# EAGLE design H1DR00 (EAGLE 9.6.0)

## Sheet 1 of 2
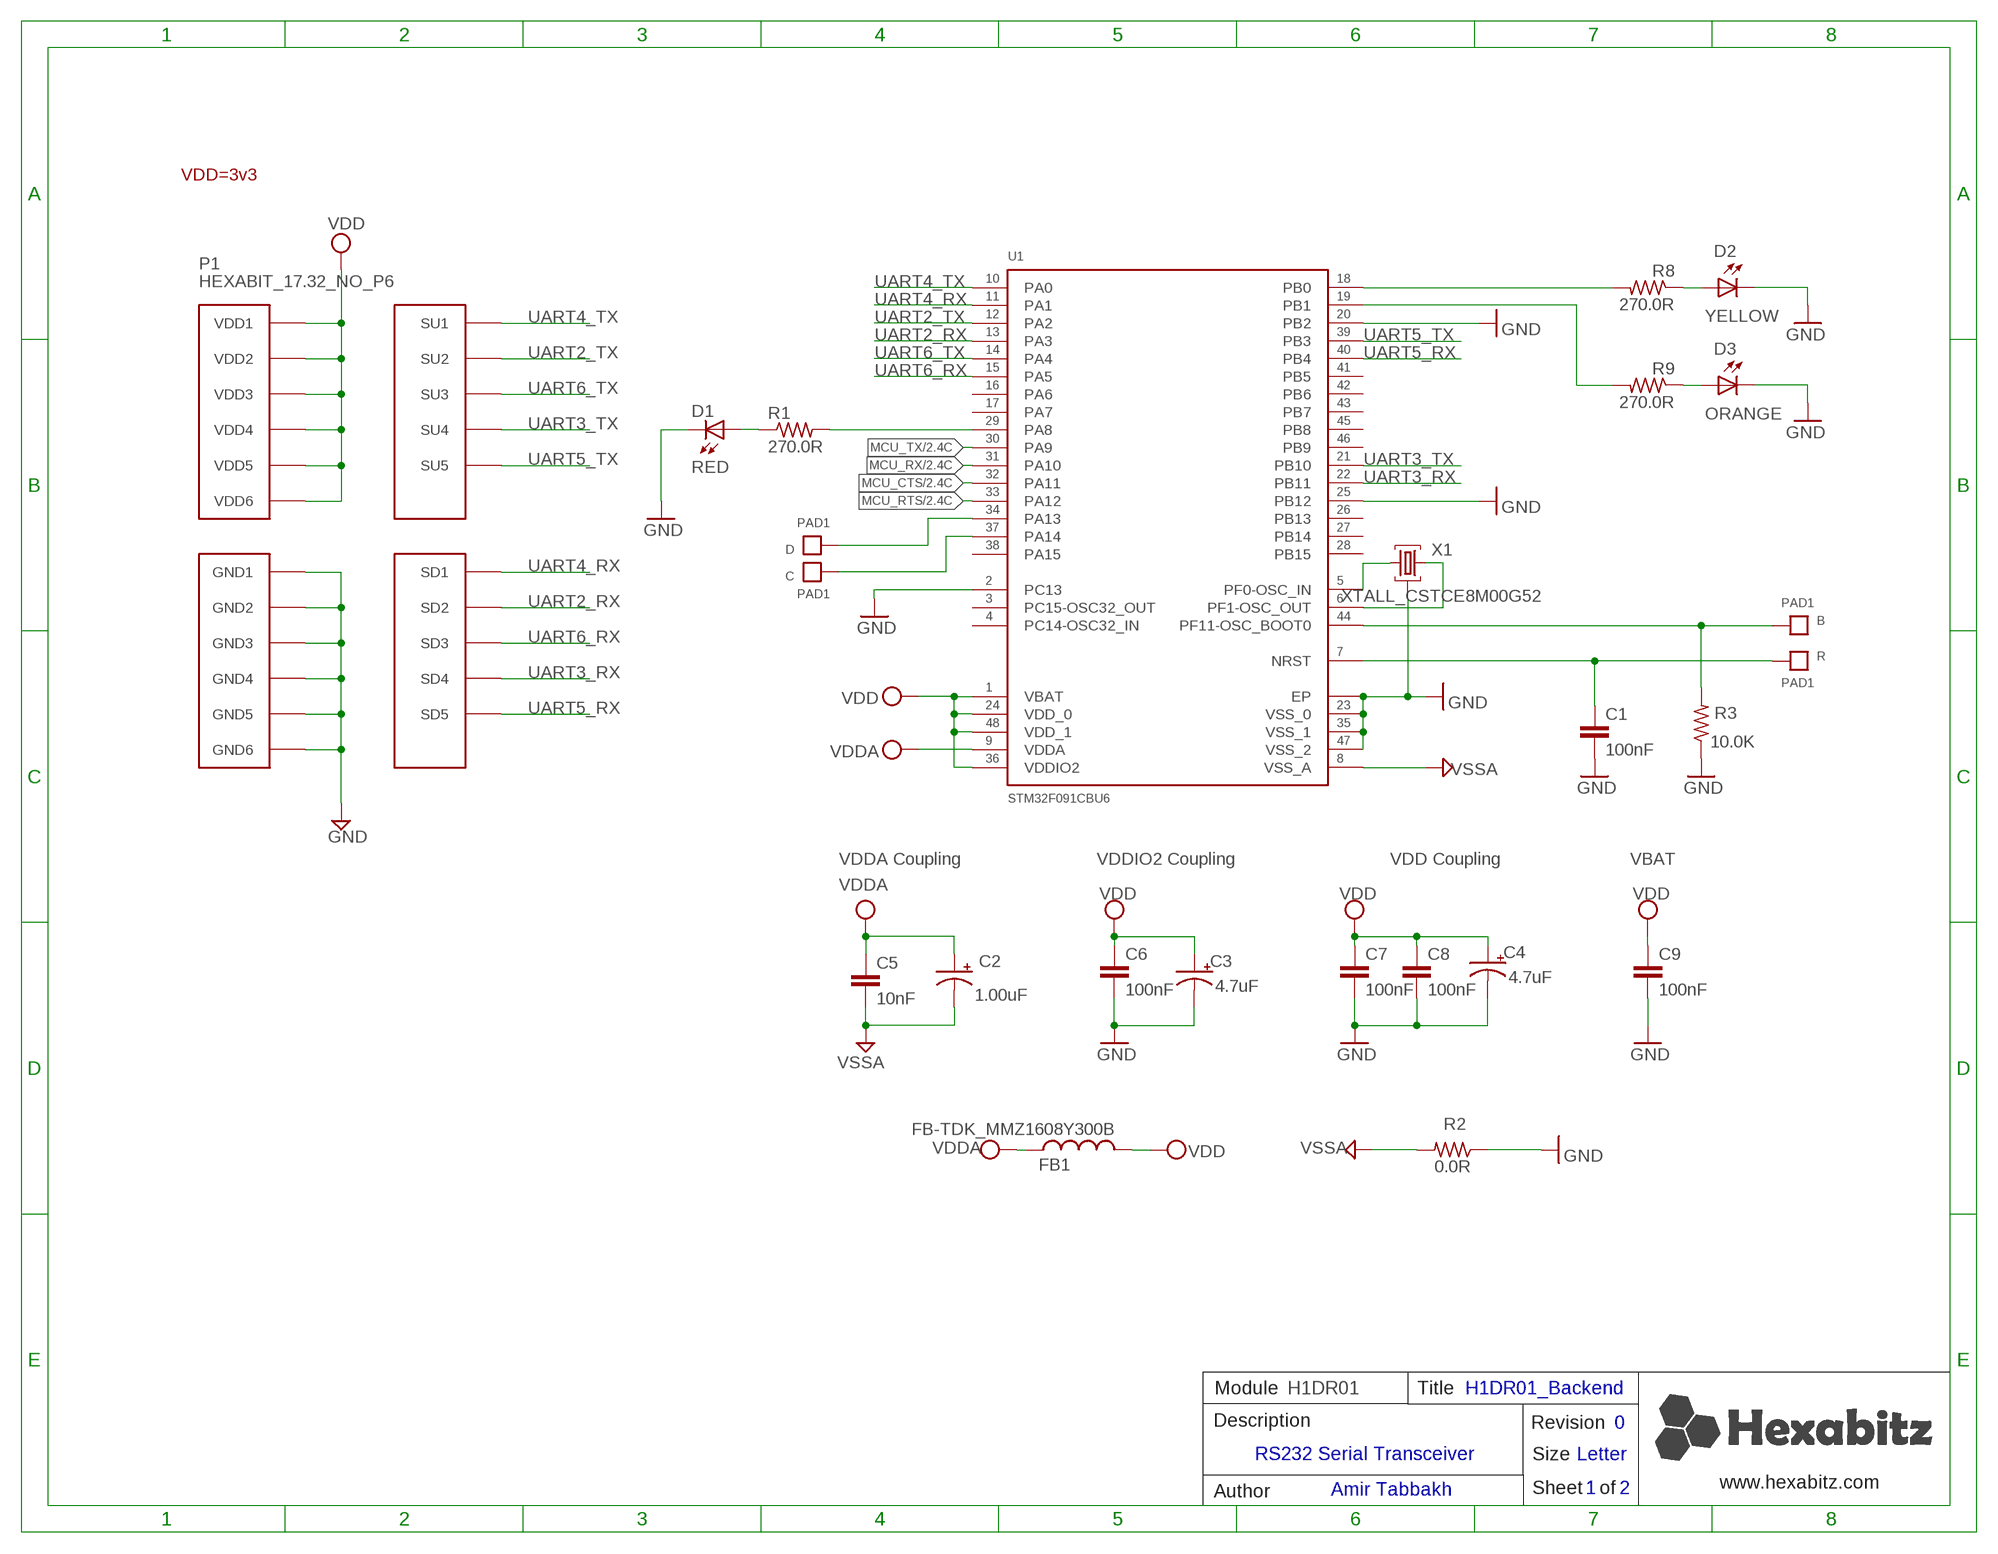
[diagram p0: schematic, sheet 1]

### Parts
B  PAD1  [PAD1]
C  PAD1  [PAD1]
C1  100nF  C-0603  [C-0603]
C2  1.00uF  C-0805-POL  [C-0805-POL]
C3  4.7uF  C-0805-POL  [C-0805-POL]
C4  4.7uF  C-0805-POL  [C-0805-POL]
C5  10nF  C-0603  [C-0603]
C6  100nF  C-0603  [C-0603]
C7  100nF  C-0603  [C-0603]
C8  100nF  C-0603  [C-0603]
C9  100nF  C-0603  [C-0603]
D  PAD1  [PAD1]
D1  RED  VLMS1300-GS08  [VLMS1300-GS08]
D2  YELLOW  VLMS1300-GS08  [VLMS1300-GS08]
D3  ORANGE  VLMS1300-GS08  [VLMS1300-GS08]
FB1  FB-TDK_MMZ1608Y300B  [FB-TDK_MMZ1608Y300B]
P1  HEXABIT_17.32_NO_P6  [HEXABIT_17.32_NO_P6]
R  PAD1  [PAD1]
R1  270.0R  R-0603  [R-0603]
R2  0.0R  R-0603  [R-0603]
R3  10.0K  R-0603  [R-0603]
R8  270.0R  R-0603  [R-0603]
R9  270.0R  R-0603  [R-0603]
U1  STM32F091CBU6  [STM32F091CBU6]
X1  XTALL_CSTCE8M00G52  [XTALL_CSTCE8M00G52]

### Nets
B1: B.P$1 B.P$2 R3.2 U1.P$44(PF11-OSC_BOOT0)
GND: C1.2 C3.2(-) C4.2(-) C6.2 C7.2 C8.2 C9.2 D1.C D2.C D3.C P1.PAD_PD7(GND1) P1.PAD_PD8(GND2) P1.PAD_PD9(GND3) P1.PAD_PD10(GND4) P1.PAD_PD11(GND5) P1.PAD_PD12(GND6) R2.1 R3.1 U1.EP U1.P$2(PC13) U1.P$20(PB2) U1.P$23(VSS_0) U1.P$25(PB12) U1.P$35(VSS_1) U1.P$47(VSS_2) X1.P$2 ; also sheet 2
MCU_CTS: U1.P$32(PA11) ; also sheet 2
MCU_RTS: U1.P$33(PA12) ; also sheet 2
MCU_RX: U1.P$31(PA10) ; also sheet 2
MCU_TX: U1.P$30(PA9) ; also sheet 2
N$1: D.P$1 D.P$2 U1.P$34(PA13)
N$2: R1.2 U1.P$29(PA8)
N$4: D1.A R1.1
N$5: U1.P$5(PF0-OSC_IN) X1.P$1
N$6: U1.P$6(PF1-OSC_OUT) X1.P$3
N$9: C.P$1 C.P$2 U1.P$37(PA14)
N$11: R8.2 U1.P$18(PB0)
N$12: D2.A R8.1
N$13: R9.2 U1.P$19(PB1)
N$14: D3.A R9.1
R1: C1.1 R.P$1 R.P$2 U1.P$7(NRST)
UART2_RX: P1.PAD_PD2(SD2) U1.P$13(PA3)
UART2_TX: P1.PAD_PU2(SU2) U1.P$12(PA2)
UART3_RX: P1.PAD_PD4(SD4) U1.P$22(PB11)
UART3_TX: P1.PAD_PU4(SU4) U1.P$21(PB10)
UART4_RX: P1.PAD_PD1(SD1) U1.P$11(PA1)
UART4_TX: P1.PAD_PU1(SU1) U1.P$10(PA0)
UART5_RX: P1.PAD_PD5(SD5) U1.P$40(PB4)
UART5_TX: P1.PAD_PU5(SU5) U1.P$39(PB3)
UART6_RX: P1.PAD_PD3(SD3) U1.P$15(PA5)
UART6_TX: P1.PAD_PU3(SU3) U1.P$14(PA4)
VDD: C3.1(+) C4.1(+) C6.1 C7.1 C8.1 C9.1 FB1.2 P1.PAD_PU7(VDD1) P1.PAD_PU8(VDD2) P1.PAD_PU9(VDD3) P1.PAD_PU10(VDD4) P1.PAD_PU11(VDD5) P1.PAD_PU12(VDD6) U1.P$1(VBAT) U1.P$24(VDD_0) U1.P$36(VDDIO2) U1.P$48(VDD_1) ; also sheet 2
VDDA: C2.1(+) C5.1 FB1.1 U1.P$9(VDDA)
VSSA: C2.2(-) C5.2 R2.2 U1.P$8(VSS_A)
Unconnected: U1.P$3(PC14-OSC32_IN) U1.P$4(PC15-OSC32_OUT) U1.P$16(PA6) U1.P$17(PA7) U1.P$26(PB13) U1.P$27(PB14) U1.P$28(PB15) U1.P$38(PA15) U1.P$41(PB5) U1.P$42(PB6) U1.P$43(PB7) U1.P$45(PB8) U1.P$46(PB9)

### Notes on the sheet
- VDD=3v3
- VDDA Coupling | VDDIO2 Coupling | VDD Coupling | VBAT
- Module | H1DR01 | Title | H1DR01_Backend
- Description | Revision | 0
- RS232 Serial Transceiver
- Size | Letter
- Amir Tabbakh | www.hexabitz.com
- Author | Sheet   of | 1 | 2
- C:/Users/Admin/Desktop/logodraft.bmp

## Sheet 2 of 2
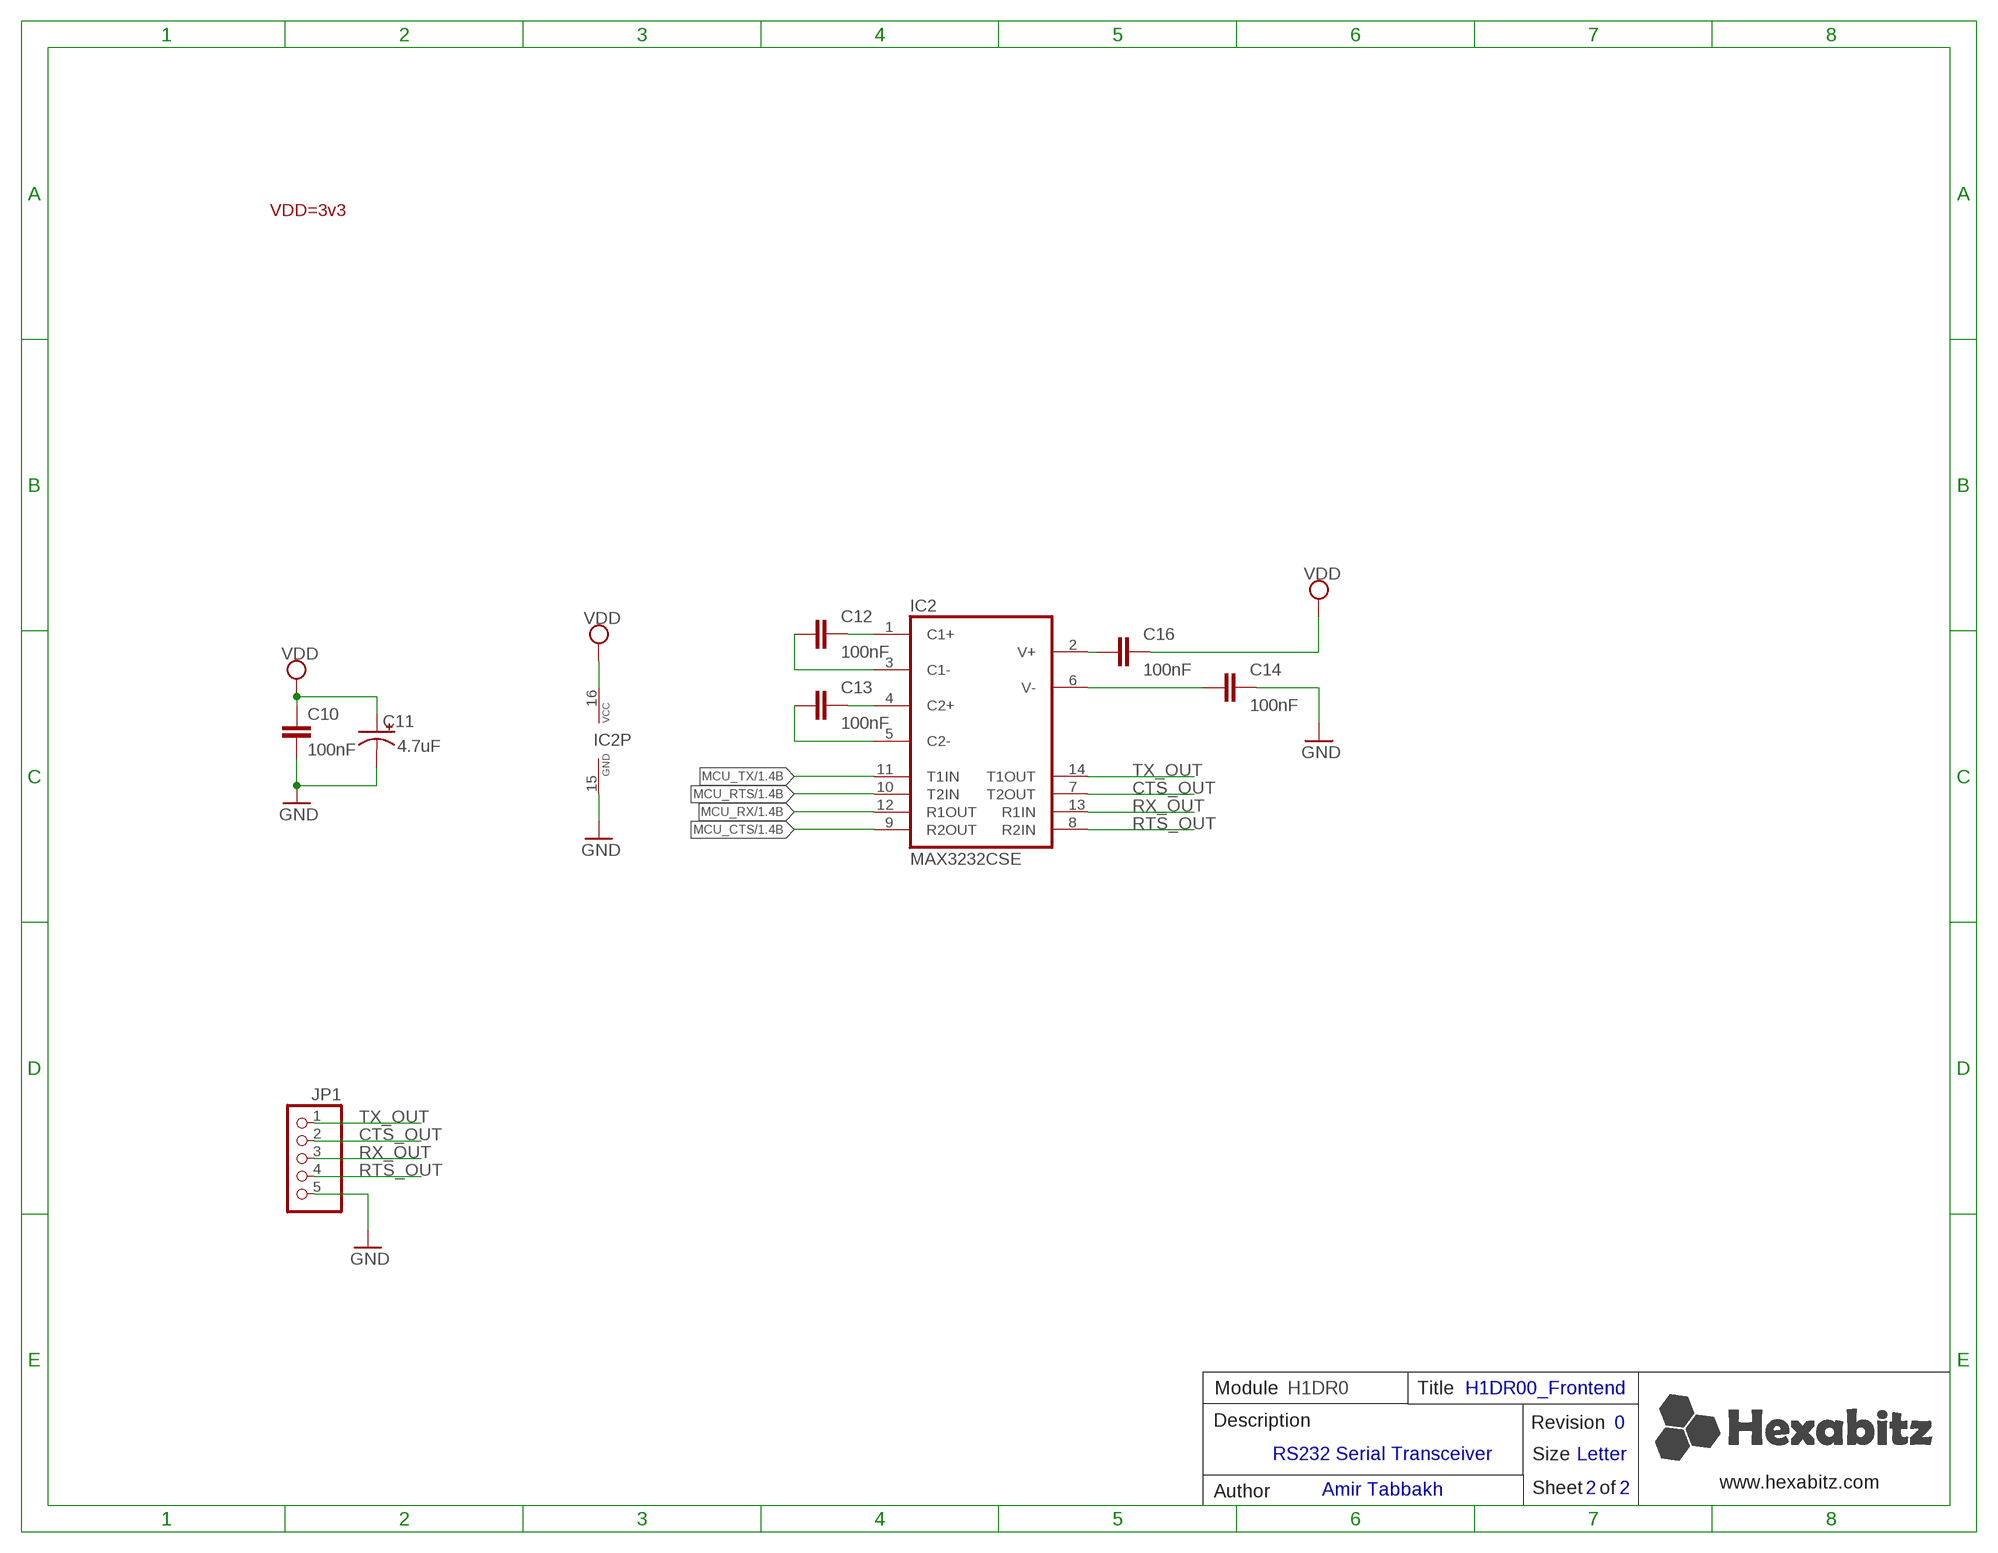
[diagram p1: schematic, sheet 2]

### Parts
C10  100nF  C-0603  [C-0603]
C11  4.7uF  C-0805-POL  [C-0805-POL]
C12  100nF  C-0603  [C-0603]
C13  100nF  C-0603  [C-0603]
C14  100nF  C-0603  [C-0603]
C16  100nF  C-0603  [C-0603]
IC2  MAX3232CSE  [SO16]
JP1  PINHD-1X5/90  [1X05/90]

### Nets
CTS_OUT: IC2.7(T2OUT) JP1.2
GND: C10.2 C11.2(-) C14.2 IC2.15(GND) JP1.5 ; also sheet 1
MCU_CTS: IC2.9(R2OUT) ; also sheet 1
MCU_RTS: IC2.10(T2IN) ; also sheet 1
MCU_RX: IC2.12(R1OUT) ; also sheet 1
MCU_TX: IC2.11(T1IN) ; also sheet 1
N$19: C14.1 IC2.6(V-)
N$20: C16.1 IC2.2(V+)
N$21: C12.2 IC2.1(C1+)
N$22: C12.1 IC2.3(C1-)
N$23: C13.2 IC2.4(C2+)
N$24: C13.1 IC2.5(C2-)
RTS_OUT: IC2.8(R2IN) JP1.4
RX_OUT: IC2.13(R1IN) JP1.3
TX_OUT: IC2.14(T1OUT) JP1.1
VDD: C10.1 C11.1(+) C16.2 IC2.16(VCC) ; also sheet 1

### Notes on the sheet
- VDD=3v3
- Module | H1DR0 | Title | H1DR00_Frontend
- Description | Revision | 0
- RS232 Serial Transceiver
- Size | Letter
- Amir Tabbakh | www.hexabitz.com
- Author | Sheet   of | 2 | 2

## Library data of the parts
B C D R = Hexabitz:PAD1
C1 C6 C8 C10 = Hexabitz:C-0603: CAP CER 10% X7R 0603; CAPACITANCE: 100nF; MFN: KEMET; MPN: C0603C104K8RACTU; OCTOPART_URL: https://octopart.com/c0603c104k8ractu-kemet-145075?r=sp&s=9bS9ASSwSEqMCE9KBEQZ0g; TOLERANCE: 10%; VOLTAGE_RATING: 10V
C2 = Hexabitz:C-0805-POL: Cap Tant Solid SMD 2012; CAPACITANCE: 1.00uF; MFN: Yageo; MPN: CC0805KKX7R7BB105; OCTOPART_URL: https://octopart.com/cc0805kkx7r7bb105-yageo-8376555?r=sp&s=YKl1wwtkROau_X5nniH2ig; TOLERANCE: 10%; VOLTAGE_RATING: 16V
C3 C4 C11 = Hexabitz:C-0805-POL: Cap Tant Solid SMD 2012; CAPACITANCE: 4.7uF; MFN: Murata; MPN: GRM21BC81E475KA12L; OCTOPART_URL: https://octopart.com/grm21bc81e475ka12l-murata-10331911?r=sp&s=RY3qZSD8T6mG6TC9CHI5qQ; TOLERANCE: 10%; VOLTAGE_RATING: 25V
C5 = Hexabitz:C-0603: CAP CER 10% X7R 0603; CAPACITANCE: 10nF; MFN: KEMET; MPN: C0603C103K5RACTU; OCTOPART_URL: https://octopart.com/c0603c103k5ractu-kemet-133094?r=sp&s=R_iPBxLnSmGqhkU2rIMFpg; TOLERANCE: 10%; VOLTAGE_RATING: 50V
C7 C12-C14 C16 = Hexabitz:C-0603: CAP CER 10% X7R 0603; CAPACITANCE: 100nF; MFN: KEMET; MPN: C0603C104K8RACTU; OCTOPART_URL: https://octopart.com/c0603c104k8ractu-kemet-145075?r=sp&s=9bS9ASSwSEqMCE9KBEQZ0g; TOLERANCE: 10%; VOLTAGE_RATING: 10
C9 = Hexabitz:C-0603: CAP CER 10% X7R 0603; CAPACITANCE: 100nF; MFN: KEMET; MPN: C0603C104K8RACTU; OCTOPART_URL: https://octopart.com/c0603c104k8ractu-kemet-145075?r=sp&s=9bS9ASSwSEqMCE9KBEQZ0g; TOLERANCE: 10V; VOLTAGE_RATING: 10%
D1 = Hexabitz:VLMS1300-GS08: Red 0603 130° Clear 54 mcd 2 V Surface Mount ChipLED ; Octopart Url : http://octopart.com/vlms1300-gs08-vishay-21709201; MFN: Vishay; MPN: VLMS1300-GS08; OCTOPART_URL: https://octopart.com/vlms1300-gs08-vishay-21709201?r=sp&s=_gcP4_q8T1SC6PJQPTQ9yA
D2 = Hexabitz:VLMS1300-GS08: Red 0603 130° Clear 54 mcd 2 V Surface Mount ChipLED ; Octopart Url : http://octopart.com/vlms1300-gs08-vishay-21709201; MFN: Vishay; MPN: VLMY1300-GS08; OCTOPART_URL: https://octopart.com/vlmy1300-gs08-vishay-21709204?r=sp; VALUE: RED
D3 = Hexabitz:VLMS1300-GS08: Red 0603 130° Clear 54 mcd 2 V Surface Mount ChipLED ; Octopart Url : http://octopart.com/vlms1300-gs08-vishay-21709201; MFN: Vishay; MPN: VLMO1300-GS08; OCTOPART_URL: https://octopart.com/vlmo1300-gs08-vishay-21709200?r=sp#; VALUE: RED
FB1 = Hexabitz:FB-TDK_MMZ1608Y300B: Ferrite Beads Multi-Layer 30Ohm 25% 100MHz 1.5A 50mOhm DCR 0603; MFN: TDK; MPN: MMZ1608Y300B; OCTOPART_URL: https://octopart.com/mmz1608y300b-tdk-368280?r=sp&s=cd9_2ZEqQ9q9UNBuQgHAiA
IC2 = Hexabitz:MAX3232*: True RS-232 Transceivers 3.0V to 5.5V, Low-Power up to 1Mbps, Using Four 0.1µF External Capacitors Source: http://pdfserv.maxim-ic.com/en/ds/MAX3222-MAX3241.pdf; MPN: MAX3232CSE; OC_FARNELL: 9725490; OC_NEWARK: 90C2890
JP1 = Hexabitz:PINHD-1X5: PIN HEADER
P1 = hexabitz_connectors:HEXABIT_?_NO_P6: Hexabitz Hexagon Module Connector Hexagon side length = 17.32mm. The following ports are removed: P6
R1 R8 R9 = Hexabitz:R-0603: Thick Film Resistors - SMD 0603; MFN: Yageo; MPN: RC0603FR-07270RL; OCTOPART_URL: https://octopart.com/search?q=RC0603FR-07270RL&start=0; RESISTANCE: 270.0 Ohm; TOLERANCE: 1%
R2 = Hexabitz:R-0603: Thick Film Resistors - SMD 0603; MFN: Yageo; MPN: RC0603JR-070RL; OCTOPART_URL: https://octopart.com/rc0603jr-070rl-yageo-1241539?r=sp&s=X2NteqRjRNWrnx42Y0aliA; RESISTANCE: 0.0 Ohm
R3 = Hexabitz:R-0603: Thick Film Resistors - SMD 0603; MFN: Yageo; MPN: RC0603JR-0710KL; OCTOPART_URL: https://octopart.com/search?q=RC0603JR-0710KL&start=0; RESISTANCE: 10.0K Ohm; TOLERANCE: 5%
U1 = Hexabitz:STM32F091CBU6: Description : ARM-based 32-bit MCU, CAN, 12 timers, ADC, DAC & Comm. Interface, 2 to 3.6 V, -40 to 85 degC, 48-Pin UFQFPN, RoHS, Tray ;Parameter : Ciiva URL : https://ciiva.com/part/STM32F091CBU6-20240708, CiivaID : 20240708, Clock Speed : 48000000.0 Hz, Lifecycle Status : Active, Mounting Style : Surface Mount, Number of Pins : 48, Octopart Url : https://octopart.com/stm32f091cbu6-stmicroelectronics-51988677, OctopartID : 5f4f955c32ec8088, RAM Memory Size : 32768 B, REACH SVHC Compliance : No SVHC, RoHS : Compliant,; MFN: STMicroelectronics; MPN: STM32F091CBU6; OCTOPART_URL: https://octopart.com/stm32f091cbu6-stmicroelectronics-51988677?r=sp&s=bU6fpgsrTZOxHyt7jkfh3w
X1 = Hexabitz:XTALL_CSTCE8M00G52: MURATA CSTCE8M00G52-R0 RESONATOR, SMD, 8MHZ ; Octopart Url : https://octopart.com/cstce8m00g52-r0-murata-7145559; MFN: Murata; MPN: CSTCE8M00G52Z-R0; OCTOPART_URL: https://octopart.com/cstce8m00g52z-r0-murata-17755941?r=sp&s=JDnNJnrHQhyS8Zk4ofFWXw

## Board
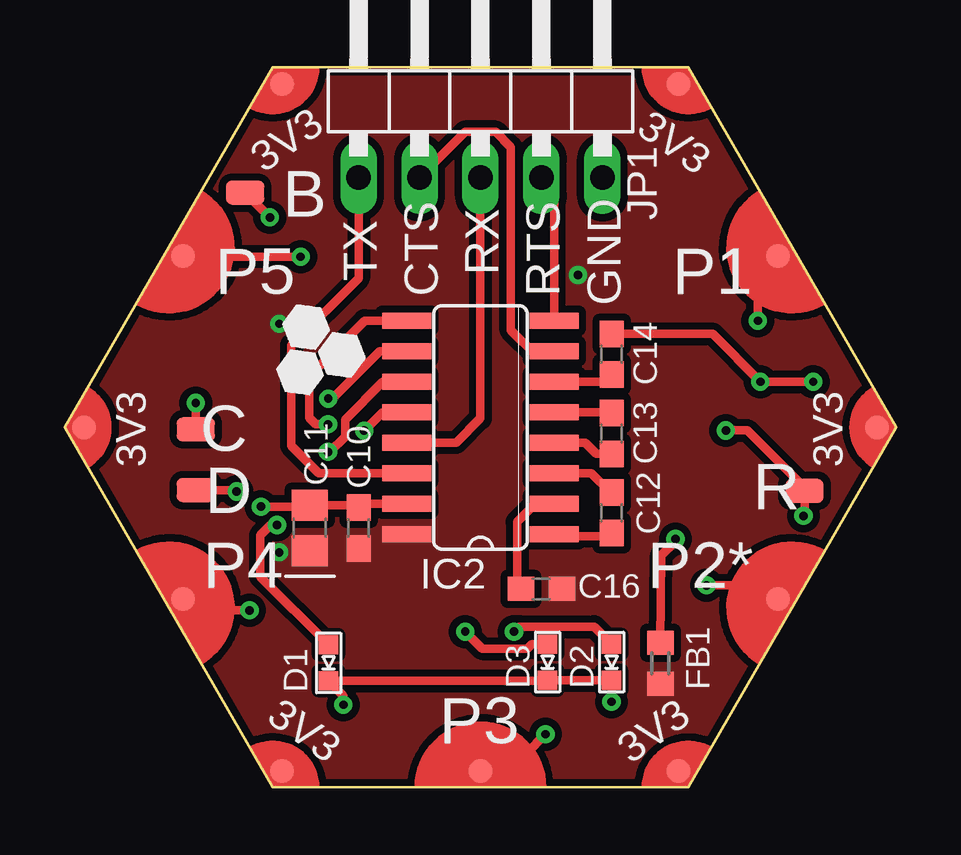
[diagram p2: board, top side]
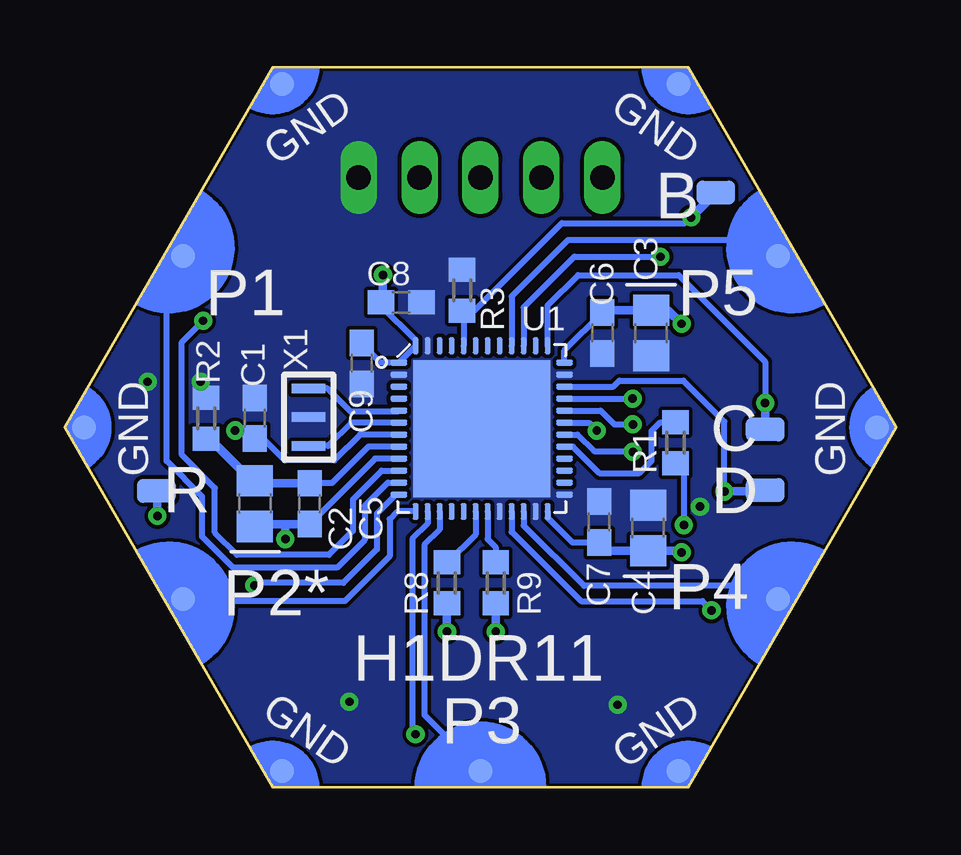
[diagram p3: board, bottom side, seen from below]

Size 34.64 x 30 mm. Coordinates in mm from the lower left corner, seen from the top.
Copper layers (1*16): Top 0.035mm / dielectric 1.5mm / Bottom 0.035mm
Design rules "2_layer": minimum track width 7mil, minimum drill 10mil, track to track 6mil, track to pad 6mil, pad to pad 6mil, via to via 6mil, smd to smd 0mil, copper to edge 1mil, drill to drill 8mil, minimum pad ring 10mil, minimum via ring 8mil, stop-mask expansion 2mil, vias tented up to drill 15mil, thermal gap 10mil

### Footprints (pad centres in the part's own frame; a part is rotated, then mirrored left to right if it is on the bottom)
PAD1 = smd 1.6 x 1: P$1 0,0 | smd 1.6 x 1 bottom: P$2 0,0
C-0603 = smd 1.1 x 1: 1 -0.85,0; 2 0.85,0
C-0805-POL = smd 1.3 x 1.5: 1 -0.95,0; 2 0.95,0
VLMS1300-GS08 = smd 0.8 x 0.8: A 0,0.75; C 0,-0.75
FB-TDK_MMZ1608Y300B = smd 1 x 1.1: 1 -0.85,0; 2 0.85,0
SO16 = smd 0.66 x 2.032: 1 -4.445,-3.073; 2 -3.175,-3.073; 3 -1.905,-3.073; 4 -0.635,-3.073; 5 0.635,-3.073; 6 1.905,-3.073; 7 3.175,-3.073; 8 4.445,-3.073; 9 4.445,3.073; 10 3.175,3.073; 11 1.905,3.073; 12 0.635,3.073; 13 -0.635,3.073; 14 -1.905,3.073; 15 -3.175,3.073; 16 -4.445,3.073
1X05/90 = drill 1.016 long: 1 -5.08,-3.81; 2 -2.54,-3.81; 3 0,-3.81; 4 2.54,-3.81; 5 5.08,-3.81
HEXABIT_17.32_NO_P6 = smd 1 x 1 bottom: PAD_PD1 12.39,7.15; PAD_PD2 12.39,-7.15; PAD_PD3 0,-14.31; PAD_PD4 -12.39,-7.15; PAD_PD5 -12.39,7.15; PAD_PD7 8.26,14.31; PAD_PD8 16.52,0; PAD_PD9 8.26,-14.31; PAD_PD10 -8.26,-14.31; PAD_PD11 -16.52,0; PAD_PD12 -8.26,14.31 | smd 1 x 1: PAD_PU1 12.39,7.15; PAD_PU2 12.39,-7.15; PAD_PU3 0,-14.31; PAD_PU4 -12.39,-7.15; PAD_PU5 -12.39,7.15; PAD_PU7 8.26,14.31; PAD_PU8 16.52,0; PAD_PU9 8.26,-14.31; PAD_PU10 -8.26,-14.31; PAD_PU11 -16.52,0; PAD_PU12 -8.26,14.31
R-0603 = smd 1 x 1.1: 1 -0.85,0; 2 0.85,0
STM32F091CBU6 = smd 5.7 x 5.7: EP 0,0 | smd 0.25 x 0.7: P$1 -2.75,-3.45; P$2 -2.25,-3.45; P$3 -1.75,-3.45; P$4 -1.25,-3.45; P$5 -0.75,-3.45; P$6 -0.25,-3.45; P$7 0.25,-3.45; P$8 0.75,-3.45; P$9 1.25,-3.45; P$10 1.75,-3.45; P$11 2.25,-3.45; P$12 2.75,-3.45; P$25 2.75,3.45; P$26 2.25,3.45; P$27 1.75,3.45; P$28 1.25,3.45; P$29 0.75,3.45; P$30 0.25,3.45; P$31 -0.25,3.45; P$32 -0.75,3.45; P$33 -1.25,3.45; P$34 -1.75,3.45; P$35 -2.25,3.45; P$36 -2.75,3.45 | smd 0.7 x 0.25: P$13 3.45,-2.75; P$14 3.45,-2.25; P$15 3.45,-1.75; P$16 3.45,-1.25; P$17 3.45,-0.75; P$18 3.45,-0.25; P$19 3.45,0.25; P$20 3.45,0.75; P$21 3.45,1.25; P$22 3.45,1.75; P$23 3.45,2.25; P$24 3.45,2.75; P$37 -3.45,2.75; P$38 -3.45,2.25; P$39 -3.45,1.75; P$40 -3.45,1.25; P$41 -3.45,0.75; P$42 -3.45,0.25; P$43 -3.45,-0.25; P$44 -3.45,-0.75; P$45 -3.45,-1.25; P$46 -3.45,-1.75; P$47 -3.45,-2.25; P$48 -3.45,-2.75
XTALL_CSTCE8M00G52 = smd 1.4 x 0.4: P$1 0,1.2; P$2 0,0; P$3 0,-1.2

### Placement (x,y rotation side)
B  7.52,24.78 0 top
C  5.46,14.92 0 top
C1  26.72,15.38 90 bottom
C2  26.72,11.82 90 bottom
C3  10.21,18.94 270 bottom
C4  10.34,10.81 90 bottom
C5  24.43,11.82 90 bottom
C6  12.24,18.94 270 bottom
C7  12.37,11.06 90 bottom
C8  20.62,20.21 0 bottom
C9  22.27,17.67 270 bottom
C10  12.24,10.81 90 top
C11  10.21,10.81 90 top
C12  22.78,11.44 270 top
C13  22.78,14.75 270 top
C14  22.78,18.05 90 top
C16  19.86,8.27 0 top
D  5.46,12.38 180 top
D1  10.99,5.19 0 top
D2  22.78,5.22 0 top
D3  20.11,5.22 0 top
FB1  24.81,5.17 270 top
IC2  17.32,15 90 top
JP1  17.32,29.22 0 top
P1  17.32,15 0 top
R  30.82,12.35 0 top
R1  9.19,14.37 90 bottom
R2  28.75,15.38 270 bottom
R3  18.08,20.72 270 bottom
R8  18.72,8.52 90 bottom
R9  16.69,8.52 90 bottom
U1  17.27,14.95 270 bottom
X1  24.48,15.43 0 bottom

### Tracks (layer width: path | path; a pad name or v marks a point on that pad's centre or on a via)
B1  (via drill 0.35)
  Top 0.356: B.P$1 v8.54,23.75
  Bottom 0.254: U1.P$44 18.02,19.8 R3.2 17.57,19.87 13.93,23.51 8.79,23.51 v8.54,23.75
  Bottom 0.356: v8.54,23.75 B.P$1
CTS_OUT
  Top 0.356: IC2.7 20.24,18.02 19.62,18.02 18.59,19.05 18.59,26.68 17.95,27.32 16.69,27.32 JP1.2
GND  (via drill 0.35)
  Top 0.254: C11.2 10.15,11.7
  Top 0.356: v11.61,3.44 11.61,3.83 D1.C 20.09,4.44 D3.C D2.C v22.78,3.57 | v31.19,16.91 v28.98,16.91 26.99,18.9 C14.2 | C11.2 12.14,11.76 C10.2 12.41,11.82 IC2.15 | 10.15,11.7 v8.18,11.7
  Bottom 0.254: R2.1 28.98,16.46
  Bottom 0.356: 28.98,16.46 v28.98,16.91
  pour Bottom (isolate 0.102, no thermals): 8.61,-0.05 25.93,-0.05 34.59,14.95 25.93,29.95 8.61,29.95 -0.05,14.95
MCU_CTS  (via drill 0.35)
  Top 0.356: IC2.9 12.49,19.45 10.18,17.13 10.18,15.41 10.46,15.13 v10.97,15.13
  Bottom 0.254: v10.97,15.13 11.74,15.13 12.31,15.7 U1.P$32
MCU_RTS  (via drill 0.35)
  Top 0.356: v10.98,16.2 11.15,16.2 13.13,18.17 IC2.10
  Bottom 0.254: v10.98,16.2 v10.99,16.2 U1.P$33
MCU_RX  (via drill 0.35)
  Top 0.356: v12.47,14.87 13.24,15.63 IC2.12
  Bottom 0.254: U1.P$31 12.79,15.19 v12.47,14.88 v12.47,14.87
MCU_TX  (via drill 0.35)
  Top 0.356: IC2.11 13.26,16.91 11.68,15.33 11.68,14.62 11.04,13.98 v10.97,13.98
  Bottom 0.254: U1.P$30 | U1.P$30 13.28,14.7 12.59,14.01 11,14.01 v10.97,13.98
N$1  (via drill 0.35)
  Top 0.356: D.P$2 7.16,12.38 v7.16,12.33
  Bottom 0.254: U1.P$34 11.79,16.7 11.53,16.95 8.87,16.95 7.16,15.24 v7.16,12.33 | 5.51,12.33 D.P$2
  Bottom 0.356: v7.16,12.33 5.51,12.33
N$2
  Bottom 0.254: U1.P$29 13.47,14.2 12.37,13.1 10.7,13.1 10.19,13.61 10.19,14.86 9.83,15.22 R1.2
N$4  (via drill 0.35)
  Top 0.356: v8.84,10.94 8.59,10.94 8.15,10.5 8.15,8.78 D1.A
  Bottom 0.254: R1.1 8.84,13.17 v8.84,10.94
N$5
  Bottom 0.254: U1.P$5 20.75,15.67 22.74,15.67 23.7,16.63 X1.P$1
N$6
  Bottom 0.254: U1.P$6 22.71,15.2 23.68,14.23 X1.P$3
N$9  (via drill 0.35)
  Top 0.356: C.P$2 v5.46,16.02
  Bottom 0.254: U1.P$37 14.52,20.09 13.26,21.35 9.07,21.35 5.46,17.74 v5.46,16.02
  Bottom 0.356: v5.46,16.02 C.P$2
N$11
  Bottom 0.254: U1.P$18 17.52,10.53 18.68,9.37 R8.2
N$12  (via drill 0.35)
  Top 0.356: v18.72,6.49 18.73,6.49 18.94,6.7 22.05,6.7 D2.A
  Bottom 0.356: R8.1 v18.72,6.49
N$13
  Bottom 0.254: R9.2 16.69,10.01 17.02,10.34 U1.P$19
N$14  (via drill 0.35)
  Top 0.356: D3.A 19.45,5.97 19.26,5.78 17.39,5.78 v16.69,6.49
  Bottom 0.356: R9.1 v16.69,6.49
N$19
  Top 0.356: C14.1 22.49,16.91 IC2.6
N$20
  Top 0.356: IC2.2 19.61,11.82 18.84,11.06 18.84,8.44 C16.1
N$21
  Top 0.356: IC2.1 20.48,10.47 22.65,10.47 C12.2
N$22
  Top 0.356: C12.1 22.74,12.29 21.94,13.09 IC2.3
N$23
  Top 0.356: IC2.4 21.68,14.37 22.15,13.9 C13.2
N$24
  Top 0.356: IC2.5 22.74,15.63 C13.1
R1  (via drill 0.35)
  Top 0.254: 30.82,12.48 R.P$1
  Top 0.356: v27.54,14.87 28.43,14.87 30.82,12.48 | R.P$1 30.82,11.36 v30.78,11.32
  Bottom 0.254: U1.P$7 22.33,14.7 23.41,13.62 25.47,13.62 26.72,14.87 | 26.72,14.87 v27.54,14.87 | C1.1 26.72,14.87
  Bottom 0.356: v30.78,11.32 30.78,12.31 R.P$1
RTS_OUT
  Top 0.356: IC2.8 20.39,24.88 JP1.4
RX_OUT
  Top 0.356: JP1.3 17.32,15.38 16.3,14.37 IC2.13
TX_OUT
  Top 0.356: JP1.1 12.24,21.22 9.45,18.43 9.45,14.24 10.59,13.09 IC2.14
UART2_RX
  Bottom 0.254: U1.P$13 20.78,11.5 21.11,11.18 21.11,9.62 22.97,7.76 27.86,7.76
  Bottom 0.356: 27.86,7.76 27.9,7.8 P1.PAD_PD2
UART2_TX  (via drill 0.35)
  Top 0.356: v26.74,8.42 29.17,8.42 29.66,7.93 P1.PAD_PU2
  Bottom 0.254: U1.P$12 20.85,12.2 21.64,11.41 21.64,9.92 23.04,8.52 26.64,8.52 v26.74,8.42
UART3_RX
  Bottom 0.254: U1.P$22 15.52,10.91 13,8.4 5,8.4
  Bottom 0.356: P1.PAD_PD4 4.88,8.27 5,8.4
UART3_TX  (via drill 0.35)
  Top 0.254: 5.26,8.14 6.02,7.38
  Top 0.356: v7.69,7.38 6.02,7.38 | P1.PAD_PU4 5.22,8.14 5.26,8.14
  Bottom 0.254: U1.P$21 16.02,10.65 13.13,7.76 8.07,7.76 v7.69,7.38
UART4_RX
  Bottom 0.254: U1.P$11 21.18,12.7 22.15,11.73 22.15,10.3 23.29,9.16 27.62,9.16 28.92,10.45 28.92,12.12 30.4,13.6 30.4,21.36 P1.PAD_PD1
UART4_TX  (via drill 0.35)
  Top 0.254: 28.88,21.32 P1.PAD_PU1
  Top 0.356: v28.88,19.45 28.88,21.32
  Bottom 0.254: U1.P$10 21.43,13.2 22.64,12 22.64,10.69 23.63,9.69 27.46,9.69 28.38,10.62 28.38,12.47 29.77,13.86 29.77,18.56 v28.88,19.45
UART5_RX
  Bottom 0.254: U1.P$40 16.02,20.46 13.66,22.81 5.58,22.81 4.88,22.12 P1.PAD_PD5
UART5_TX  (via drill 0.35)
  Top 0.356: P1.PAD_PU5 4.89,22.11 v9.83,22.11
  Bottom 0.254: U1.P$39 15.52,20 13.41,22.11 v9.83,22.11
UART6_RX
  Bottom 0.254: U1.P$15 19.02,10.74 19.65,10.1 19.65,3.02 17.81,1.18
  Bottom 0.356: P1.PAD_PD3 17.81,1.18
UART6_TX  (via drill 0.35)
  Top 0.254: 19.22,1.41 17.7,1.41
  Top 0.356: v20.03,2.22 19.22,1.41 | 17.7,1.41 17.27,0.98 P1.PAD_PU3
  Bottom 0.254: U1.P$14 19.52,10.99 20.15,10.36 20.15,2.34 v20.03,2.22
VDD  (via drill 0.35)
  Bottom 0.254: U1.P$24 14.52,11.25 13.49,10.21 C7.1 | 21.47,20.08 20.02,18.63 U1.P$48 U1.P$1 21.48,17.7 22.27,18.49 C9.1 | U1.P$36 13.82,18.21 C6.1 | C8.1 21.38,20.21
  Bottom 0.356: C7.1 12.01,9.86 C4.1 9,9.86 v8.94,9.79 | 21.47,20.08 C8.1 | C6.1 12.14,19.89 C3.1 9.51,19.89 v8.94,19.32 | v21.38,21.35 21.38,20.21
  pour Top (isolate 0.305, no thermals): 8.61,-0.05 25.93,-0.05 34.59,14.95 25.93,29.95 8.61,29.95 -0.05,14.95
VDDA  (via drill 0.35)
  Top 0.356: FB1.1 24.86,9.67 25.41,10.22 25.41,10.31 v25.45,10.35
  Bottom 0.254: U1.P$9 21.71,13.7 C5.1 | 26.62,10.98 C2.1
  Bottom 0.356: C5.1 25.45,10.98 | 25.45,10.98 26.62,10.98 | v25.45,10.35 25.45,10.98
VSSA
  Bottom 0.254: U1.P$8 21.99,14.2 23.51,12.68 C5.2 | C2.2 26.62,12.67
  Bottom 0.356: 26.62,12.67 C5.2 | C2.2 26.84,12.77 28.6,14.53 R2.2

### Text on the board
tPlace: 3V3 | 3V3 | P5 | TX | RX | P1 | CTS | RTS | GND | 3V3 | 3V3 | P4 | P2* | 3V3 | P3 | 3V3
bPlace: GND | GND | P5 | P1 | GND | GND | P4 | P2* | H1DR11 | GND | P3 | GND
bNames: B | C | R | D